# Altium project lightSoakV1-illumination.PrjPcb
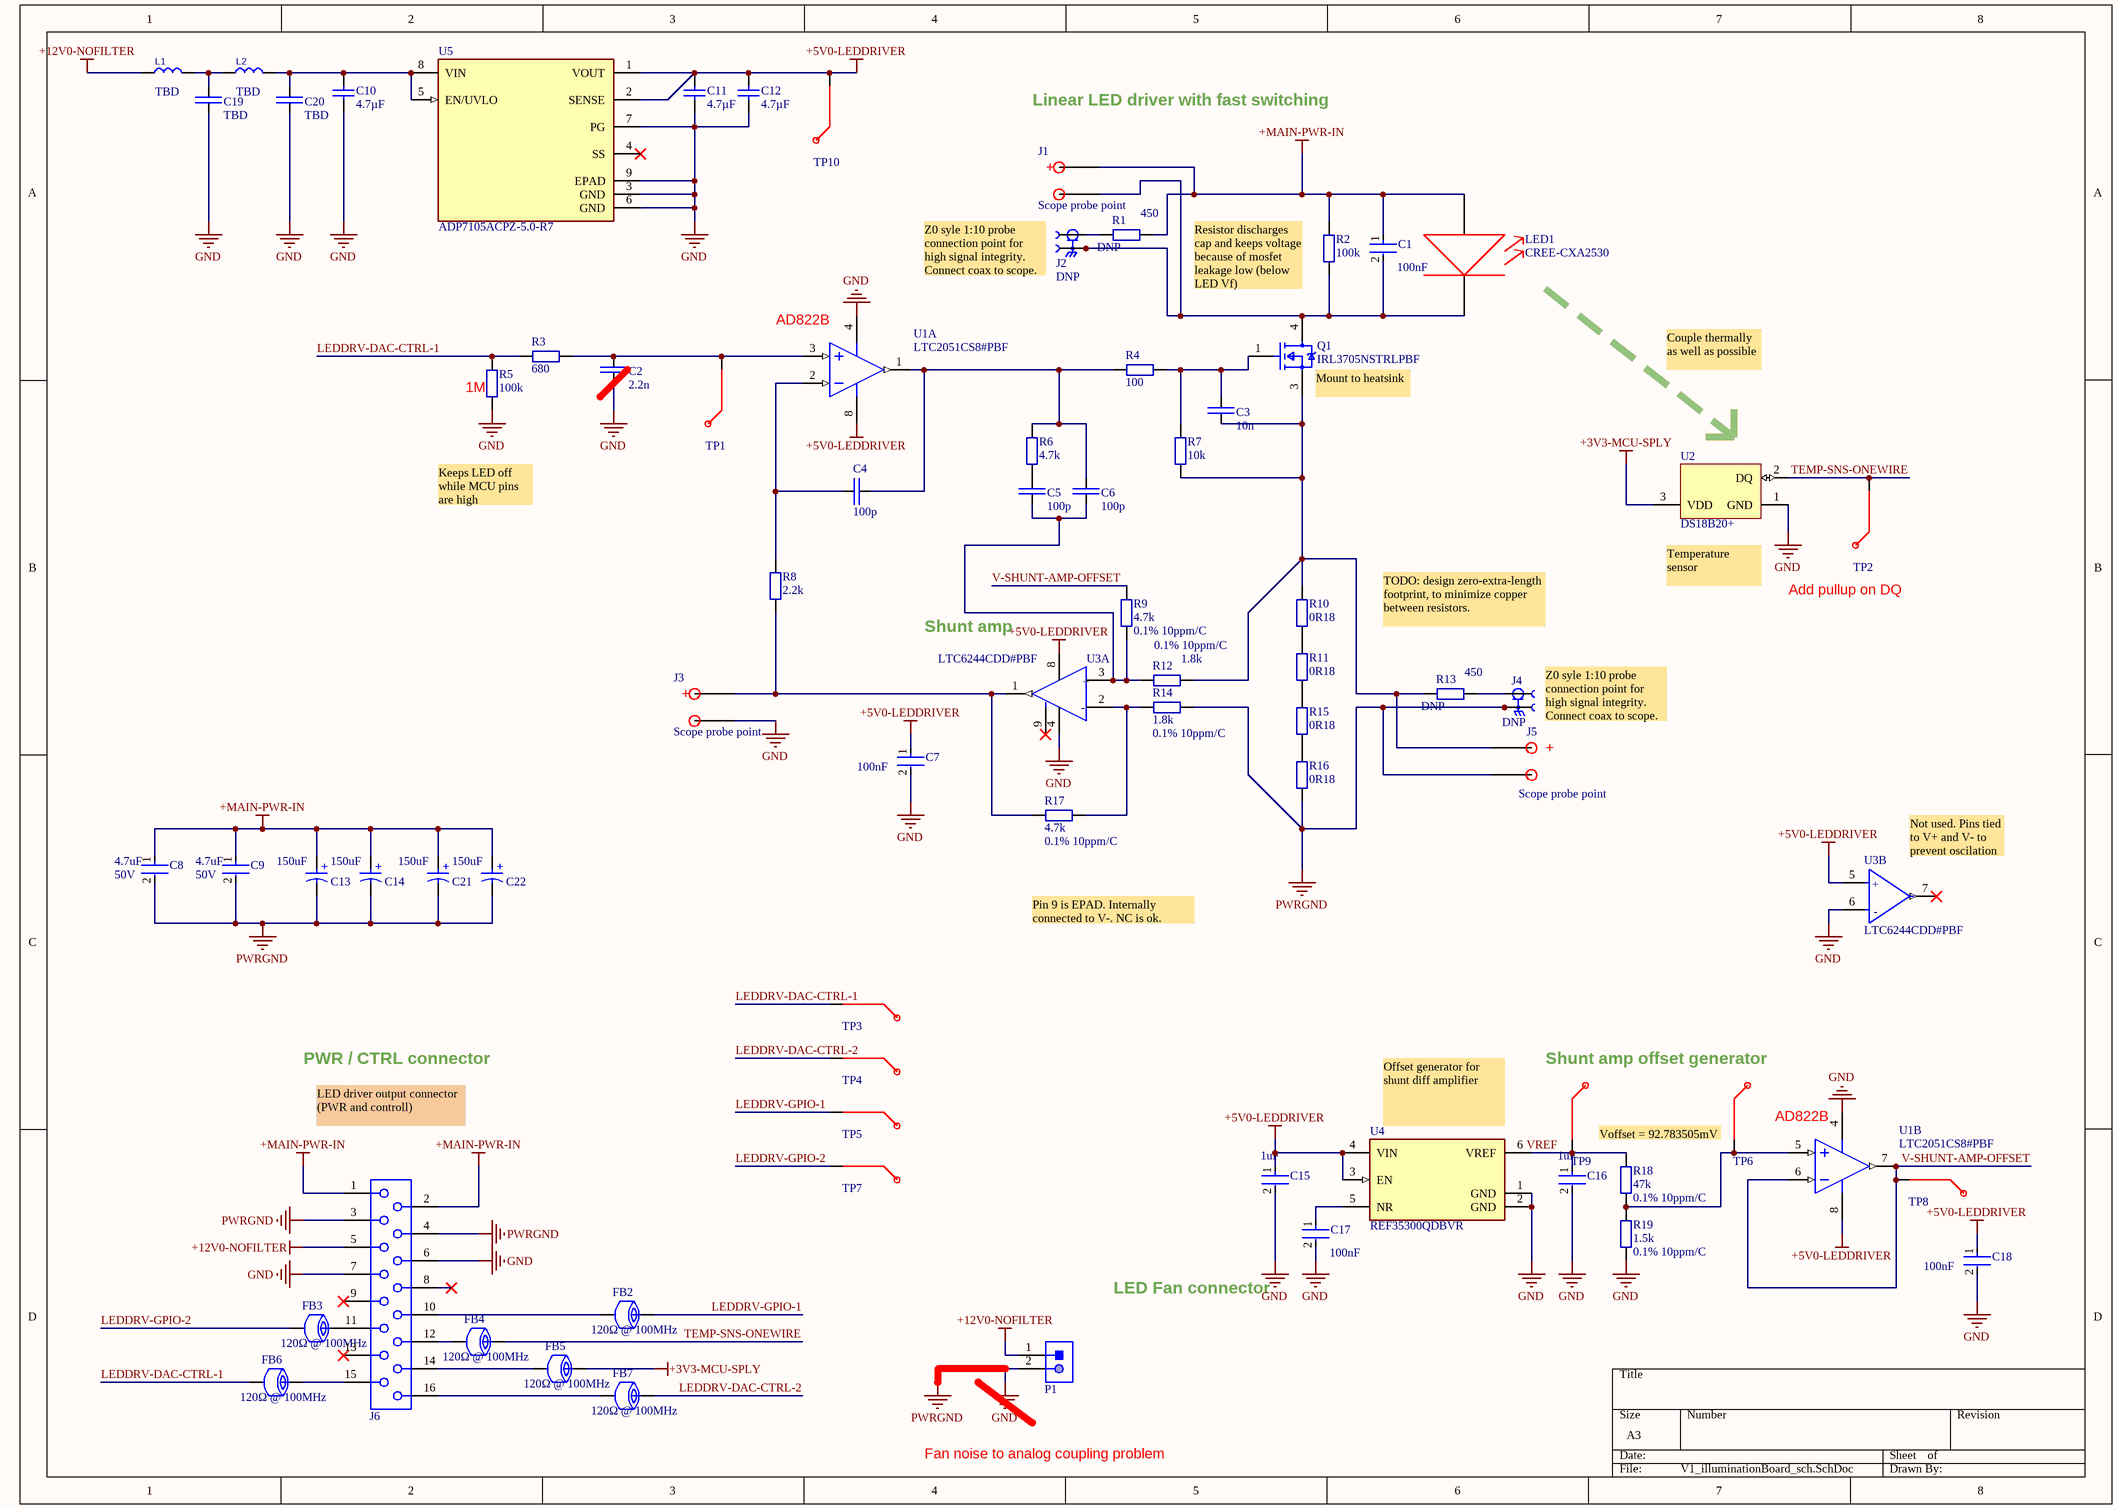
[diagram p0: V1_illuminationBoard_sch.SchDoc]
1 sheet, 73 parts. Net scope: global (net labels, ports and power ports of the same name join across sheets).
Board file: V1-PCB-illumination.PcbDoc

## Sheet V1_illuminationBoard_sch.SchDoc
size A3; SheetNumber: 1; SheetTotal: 1; SPICEModelCacheTWAAQUGS: <root> / <DocumentId>TWAAQUGS</DocumentId> / <CacheFrame Number="0"> / <Model Name="865060657011_150uf" Kind="CKT"> / <Text>******* / .subckt 865060657011_150uF 1 2 / Rser 1 3 0.14 / Lser 2 4 6.4296689103223E-09 / C1 3 4 0.00015 / Rpar 3 4 666666.666666667 / .ends 865060657011_150uF</Text> / </Model> / </CacheFrame> / </root>

### Parts
C1  Capacitance: 100nF  [FP-885012206095-IPC_B]  (hidden comment: 885012206095)
C2  value 2.2n  [FPR_0603_C_R0]  (hidden comment: PN_C0603_2n2)
C3  value 10n  [FPR_0603_C_R0]  (hidden comment: PN_C0603_10n)
C4  value 100p  [FPR_0603_C_R0]  (hidden comment: PN_C0603_100p)
C5  value 100p  [FPR_0603_C_R0]  (hidden comment: PN_C0603_100p)
C6  value 100p  [FPR_0603_C_R0]  (hidden comment: PN_C0603_100p)
C7  Capacitance: 100nF  [FP-885012206095-IPC_B]  (hidden comment: 885012206095)
C8  Voltage Rating (DC): 50V  Capacitance: 4.7uF  [FP-885012208094-IPC_B]  (hidden comment: 885012208094)
C9  Voltage Rating (DC): 50V  Capacitance: 4.7uF  [FP-885012208094-IPC_B]  (hidden comment: 885012208094)
C10  Capacitance: 4.7µF  [WCAP-CSGP_0805_L2W1.25H1.25]  (hidden comment: 885012107018)
C11  Capacitance: 4.7µF  [WCAP-CSGP_0805_L2W1.25H1.25]  (hidden comment: 885012107018)
C12  Capacitance: 4.7µF  [WCAP-CSGP_0805_L2W1.25H1.25]  (hidden comment: 885012107018)
C13  Capacitance: 150uF  [WCAP-ASLL_D10H10.5]  (hidden comment: 865060657011)
C14  Capacitance: 150uF  [WCAP-ASLL_D10H10.5]  (hidden comment: 865060657011)
C15  Capacitance: 1uF  [FP-885012207078-IPC_B]  (hidden comment: 885012207078)
C16  Capacitance: 1uF  [FP-885012207078-IPC_B]  (hidden comment: 885012207078)
C17  Capacitance: 100nF  [FP-885012206095-IPC_B]  (hidden comment: 885012206095)
C18  Capacitance: 100nF  [FP-885012206095-IPC_B]  (hidden comment: 885012206095)
C19  value TBD  [FPR_0603_C_R0]  (hidden comment: PN_C0603_TBD)
C20  value TBD  [FPR_0603_C_R0]  (hidden comment: PN_C0603_TBD)
C21  Capacitance: 150uF  [WCAP-ASLL_D10H10.5]  (hidden comment: 865060657011)
C22  Capacitance: 150uF  [WCAP-ASLL_D10H10.5]  (hidden comment: 865060657011)
FB2  120Ω @ 100MHz  [SMD_0805]
FB3  120Ω @ 100MHz  [SMD_0805]
FB4  120Ω @ 100MHz  [SMD_0805]
FB5  120Ω @ 100MHz  [SMD_0805]
FB6  120Ω @ 100MHz  [SMD_0805]
FB7  120Ω @ 100MHz  [SMD_0805]
J1  Scope probe point  [scope with ground spring probe point]
J2  CONUFL001-SMD-T  [LINX_CONUFL001-SMD-T]  (value not drawn)
J3  Scope probe point  [scope with ground spring probe point]
J4  CONUFL001-SMD-T  [LINX_CONUFL001-SMD-T]  (value not drawn)
J5  Scope probe point  [scope with ground spring probe point]
J6  690368191672  [690368191672]  (value not drawn)
L1  value TBD  [FPR_1216_R_R0]  (hidden comment: L-TBD)
L2  value TBD  [FPR_1216_R_R0]  (hidden comment: L-TBD)
LED1  CREE-CXA2530  [CXA2530-SolderMount]
P1  61300211121  [61300211121]  (value not drawn)
Q1  IRL3705NSTRLPBF  [FP-PG-TO263-3-MFG]
R1  value 450  [FPR_0603_R_R0]  (hidden comment: PN_R0603_450R)
R2  value 100k  [FPR_0603_R_R0]  (hidden comment: PN_R0603_100k)
R3  value 680  [FPR_0603_R_R0]  (hidden comment: PN_R0603_680R)
R4  value 100  [FPR_0603_R_R0]  (hidden comment: PN_R0603_100R)
R5  value 100k  [FPR_0603_R_R0]  (hidden comment: PN_R0603_100k)
R6  value 4.7k  [FPR_0603_R_R0]  (hidden comment: PN_R0603_4k7)
R7  value 10k  [FPR_0603_R_R0]  (hidden comment: PN_R0603_10k)
R8  value 2.2k  [FPR_0603_R_R0]  (hidden comment: PN_R0603_2k2)
R9  value 4.7k  Tolerance: 0.1% 10ppm/C  [FPR_0603_R_R0]  (hidden comment: PN_R0603_4k7_0%1_10ppm)
R10  value 0R18  [FPR_CRF2512_R0-endToEnd]  (hidden comment: TLRP3A30CR180FTE)
R11  value 0R18  [FPR_CRF2512_R0-endToEnd]  (hidden comment: TLRP3A30CR180FTE)
R12  value 1.8k  Tolerance: 0.1% 10ppm/C  [FPR_0603_R_R0]  (hidden comment: PN_R0603_1k8_0%1_10ppm)
R13  value 450  [FPR_0603_R_R0]  (hidden comment: PN_R0603_450R)
R14  value 1.8k  Tolerance: 0.1% 10ppm/C  [FPR_0603_R_R0]  (hidden comment: PN_R0603_1k8_0%1_10ppm)
R15  value 0R18  [FPR_CRF2512_R0-endToEnd]  (hidden comment: TLRP3A30CR180FTE)
R16  value 0R18  [FPR_CRF2512_R0-endToEnd]  (hidden comment: TLRP3A30CR180FTE)
R17  value 4.7k  Tolerance: 0.1% 10ppm/C  [FPR_0603_R_R0]  (hidden comment: PN_R0603_4k7_0%1_10ppm)
R18  value 47k  Tolerance: 0.1% 10ppm/C  [FPR_0603_R_R0]  (hidden comment: PN_R0603_47k_0%1_10ppm)
R19  value 1.5k  Tolerance: 0.1% 10ppm/C  [FPR_0603_R_R0]  (hidden comment: PN_R0603_1k5_0%1_10ppm)
TP1  Test Point  [Test Point 1.5mm SMD]  (value not drawn)
TP2  Test Point  [Test Point 1.5mm SMD]  (value not drawn)
TP3  Test Point  [Test Point 1.5mm SMD]  (value not drawn)
TP4  Test Point  [Test Point 1.5mm SMD]  (value not drawn)
TP5  Test Point  [Test Point 1.5mm SMD]  (value not drawn)
TP6  Test Point  [Test Point 1.5mm SMD]  (value not drawn)
TP7  Test Point  [Test Point 1.5mm SMD]  (value not drawn)
TP8  Test Point  [Test Point 1.5mm SMD]  (value not drawn)
TP9  Test Point  [Test Point 1.5mm SMD]  (value not drawn)
TP10  Test Point  [Test Point 1.5mm SMD]  (value not drawn)
U1  LTC2051CS8#PBF  [LT-S8-8_N]  (parts A,B of 2)
U2  DS18B20+  [to-92 horiyontal boardhole]
U3  LTC6244CDD#PBF  [FP-DD-8-05-08-1698-IPC_A]  (parts A,B of 2)
U4  REF35300QDBVR  [FP-DBV0006A-MFG]
U5  ADP7105ACPZ-5.0-R7  [FP-CP-8-5-IPC_C]

### Nets
+3V3-MCU-SPLY: FB5.1 U2.3(VDD)
+5V0-LEDDRIVER: C7.1 C11.2 C12.2 C15.1 C18.1 TP10.1 U1.8(V+) U3.5(+IN_B) U3.8(V+) U4.3(EN) U4.4(VIN) U5.1(VOUT) U5.2(SENSE)
+12V0-NOFILTER: J6.5 L1.1 P1.1
+MAIN-PWR-IN: C1.1 C8.1 C9.1 C13.1(P) C14.1(P) C21.1(P) C22.1(P) J1.POS J6.1 J6.2 LED1.POS R1.2 R2.2
GND: C2.2 C7.2 C10.1 C11.1 C12.1 C15.2 C16.2 C17.2 C18.2 C19.1 C20.1 J3.NEG J6.6 J6.7 P1.2 R5.1 R19.2 U1.4(V-) U2.1(GND) U3.4(V-) U3.6(-IN_B) U4.1(GND) U4.2(GND) U5.3(GND) U5.6(GND) U5.7(PG) U5.9(EPAD)
PWRGND: C8.2 C9.2 C13.2(N) C14.2(N) C21.2(N) C22.2(N) J4.2 J4.3 J5.NEG J6.3 J6.4 R14.2 R16.1
LEDDRV-DAC-CTRL-1: FB6.2 R3.2 R5.2 TP3.1
LEDDRV-DAC-CTRL-2: FB7.1 TP4.1
LEDDRV-GPIO-1: FB2.1 TP5.1
LEDDRV-GPIO-2: FB3.2 TP7.1
TEMP-SNS-ONEWIRE: FB4.1 TP2.1 U2.2(DQ)
V-SHUNT-AMP-OFFSET: R9.2 TP8.1 U1.6(-IN_B) U1.7(OUT_B)
VREF: C16.1 R18.1 TP9.1 U4.6(VREF)
NetC1_2: C1.2 J1.NEG J2.2 J2.3 LED1.NEG Q1.4(DRAIN) R2.1
NetC2_1: C2.1 R3.1 TP1.1 U1.3(+IN_A)
NetC3_1: C3.1 J5.POS Q1.3(SOURCE) R7.1 R10.2 R12.1 R13.2
NetC3_2: C3.2 Q1.1(GATE) R4.2 R7.2
NetC4_1: C4.1 C6.1 R4.1 R6.2 U1.1(OUT_A)
NetC4_2: C4.2 R8.2 U1.2(-IN_A)
NetC5_1: C5.1 R6.1
NetC5_2: C5.2 C6.2 R9.1 R12.2 U3.3(+IN_A)
NetC10_2: C10.2 C20.2 L2.2 U5.5(EN/UVLO) U5.8(VIN)
NetC17_1: C17.1 U4.5(NR)
NetC19_2: C19.2 L1.2 L2.1
NetFB2_2: FB2.2 J6.10
NetFB3_1: FB3.1 J6.11
NetFB4_2: FB4.2 J6.12
NetFB5_2: FB5.2 J6.14
NetFB6_1: FB6.1 J6.15
NetFB7_2: FB7.2 J6.16
NetJ2_1: J2.1 R1.1
NetJ3_POS: J3.POS R8.1 R17.1 U3.1(OUT_A)
NetJ4_1: J4.1 R13.1
NetR10_1: R10.1 R11.2
NetR11_1: R11.1 R15.2
NetR14_1: R14.1 R17.2 U3.2(-IN_A)
NetR15_1: R15.1 R16.2
NetR18_2: R18.2 R19.1 TP6.1 U1.5(+IN_B)

Not connected (* = marked no-connect by the designer): J6 8* 9* 13*; U3 7(OUT_B)* 9(V-)*; U5 4(SS)*

### Notes on the sheet
- Linear LED driver with fast switching
- (near J2) Z0 syle 1:10 probe connection point for high signal integrity. Connect coax to scope.
- (near R2) Resistor discharges cap and keeps voltage because of mosfet leakage low (below LED Vf)
- (near U1) AD822B
- Couple thermally as well as possible
- (near R5) 1M
- (near Q1) Mount to heatsink
- Keeps LED off while MCU pins are high impedance
- (near U2) Temperature sensor
- Shunt amp
- TODO: design zero-extra-length footprint, to minimize copper between resistors.
- Add pullup on DQ
- (near J4) Z0 syle 1:10 probe connection point for high signal integrity. Connect coax to scope.
- (near U3) Not used. Pins tied to V+ and V- to prevent oscilation
- Pin 9 is EPAD. Internally connected to V-. NC is ok.
- PWR / CTRL connector
- Shunt amp offset generator
- LED driver output connector (PWR and controll)
- (near U4) Offset generator for shunt diff amplifier
- Voffset = 92.783505mV
- LED Fan connector
- Fan noise to analog coupling problem
- Labels drawn without touching a wire or pin: PWRGND
- (in symbol 865060657011) +
- (in symbol CMP-09116-000458-1, part A) +
- (in symbol CMP-09116-000458-1, part B) +
- (in symbol Scope probe point) +

### Library data of the parts
C1 C7 C17 C18 = CMP-207839-000004-1: CAP CER 0.1UF 50V X7R 0603; Tolerance: 10%; RoHS Compliant: Yes; Thickness: 0.037inch; Voltage Rating: 50V; Packaging: Cut Tape; Dielectric: X7R; Series: WCAP-CSGP; Width: 0.031inch; Max Operating Temperature: 125°C; Min Operating Temperature: -55°C; Case/Package: 0603; Case Code (Metric): 1608; Case Code (Imperial): 0603; Length: 0.063inch; Mount: Surface Mount; Voltage Rating (DC): 50V
C2-C6 C19 C20 = C: Capacitor - generic SMD
C8 C9 = CMP-207839-000019-1: CAP CER 4.7UF 50V X7R 1206; Tolerance: 10%; Mount: Surface Mount; Width: 0.063inch; Min Operating Temperature: -55°C; RoHS Compliant: Yes; Dielectric: X7R; Series: WCAP-CSGP; Case Code (Metric): 3216; Case/Package: 1206; Max Operating Temperature: 125°C; Thickness: 0.075inch; Packaging: Cut Tape; Length: 0.126inch; Voltage Rating: 50V; Case Code (Imperial): 1206
C10-C12 = 885012107018: WCAP-CSGP Multilayer Ceramic Chip Capacitor, General Purpose, size 0805, X5R, 4.7µF, 25VDC; Manufacturer: Wurth Elektronik; Case/Size Code: 0805; Capacitance Tolerance: +/-20%; Dissipation Factor: 10%; Insulation Resistance: 0.02GΩ; Rated Voltage (DC): 25V; Technical Reference: X5R0805475M025DFCT10000; Manufacturer Part Number: 885012107018; Category: Multilayer Ceramic Chip Capacitors; Match Code: WCAP-CSGP; ComponentLink1Description: Website Link; ComponentLink1URL: https://www.we-online.com/redexpert/article/885012107018?ad; ComponentLink2Description: Datasheet Link; ComponentLink2URL: https://www.we-online.com/redexpert/spec/885012107018?ad; Mount: Surface Mount; Operating Temperature Max: 85°C; Operating Temperature Min: -55°C; Packaging: Tape and Reel; Length: 2mm; Width: 1.25mm; Height: 1.25mm; Ceramic Type: X5R
C13 C14 C21 C22 = 865060657011: WCAP-ASLL Aluminum Electrolytic Capacitor, V-Chip, D10 x H10.5mm, 150µF, 50V; Manufacturer: Wurth Elektronik; Capacitance Tolerance: +/-20%; Dissipation Factor: 12%; Endurance: 5000h; Leakage Current: 75uA; Ripple Current: 555mA; Technical Reference: ASEF105151M050DVCTEE000; Manufacturer Part Number: 865060657011; Category: Aluminum Electrolytic Capacitors; Match Code: WCAP-ASLL; ComponentLink1Description: Website Link; ComponentLink1URL: https://www.we-online.com/redexpert/article/865060657011?ad; ComponentLink2Description: Datasheet Link; ComponentLink2URL: https://www.we-online.com/redexpert/spec/865060657011?ad; Mount: Surface Mount; Operating Temperature Max: 105°C; Operating Temperature Min: -55°C; Packaging: Tape and Reel; Height: 10.5mm; Diameter: 10mm; Rated Voltage (DC): 50V
C15 C16 = CMP-207839-000010-1: CAP CER 1UF 25V X7R 0805; Tolerance: 10%; Series: WCAP-CSGP; Mount: Surface Mount; RoHS Compliant: Yes; Case Code (Metric): 2012; Width: 0.049inch; Thickness: 0.053inch; Dielectric: X7R; Max Operating Temperature: 125°C; Case Code (Imperial): 0805; Case/Package: 0805; Length: 0.079inch; Voltage Rating: 25V; Packaging: Cut Tape; Min Operating Temperature: -55°C; Voltage Rating (DC): 25V
FB2-FB7 = BLM21AG121SN1D: Ferrite Bead, 0805 [2012 Metric], 120 ohm, 800 mA, BLM21A Series, 0.15 ohm, ± 25%; Manufacturer: Murata; Dealer number: 1515617; Dealer: Farnell; DC resistance: 0.15Ω; Max current: 0.2A; Category: ferite beads; Price: 0.082; Manufacturer Number: BLM21AG121SN1D; AC resistance: 120Ω; Frequency: 100MHz; Case: 0805; Technology: SMT; HelpURL: https://www.farnell.com/datasheets/1914683.pdf
J2 J4 = CONUFL001-SMD-T: U.FL (UMCC) Connector Jack, Male Pin 50Ohm Surface Mount Solder; MF: Linx; Price: None; MP: CONUFL001-SMD-T; Package: None; Value: *; Check_prices: https://www.snapeda.com/parts/CONUFL001-SMD-T/Linx/view-part/?ref=eda; Availability: Unavailable; SnapEDA_Link: https://www.snapeda.com/parts/CONUFL001-SMD-T/Linx/view-part/?ref=snap; DNP: DNP
J6 = 690368191672: WR-MM Mini Module Connector, Female, THT, with Latch & Polarization, Angled, pitch 2.54mm, 16p; Manufacturer: Wurth Elektronik; Contact Resistance: 10mΩ; Insulation Resistance: 1000MΩ; Rated Current: 1.5A; Working Voltage: 250VAC; Withstanding Voltage: 500VAC; ComponentLink1Description: Website Link; ComponentLink1URL: https://www.we-online.com/redexpert/article/690368191672?ad; ComponentLink2Description: Datasheet Link; ComponentLink2URL: https://www.we-online.com/redexpert/spec/690368191672?ad; Manufacturer Part Number: 690368191672; Category: Board-to-Board Connectors; Match Code: WR-MM; Mount: Through Hole; Operating Temperature Max: 105°C; Operating Temperature Min: -40°C; Packaging: Tube; Length: 24.92mm; Gender: Female; Number of Pins: 16; Orientation: Angled; Pitch: 2.54mm
L1 L2 = L: Inductor - generic SMD
LED1 = CREE CXA2530: High power LED
P1 = CMP-1712-00002-4: THT Vertical Pin Header WR-PHD, Pitch 2.54 mm, Single Row, 2 pins; Manufacturer: Wurth Elektronik; Rated Current: 3A; Gender: Male; Withstanding Voltage: 500VAC; Working Voltage: 250VAC; Pitch: 2.54mm; Contact Resistance: 20mOhm; Pin Number: 2; Mounting Technology: THT; Orientation: Vertical; Operating Temperature: -40to105degC; Packaging: Bag; Publisher: WurthElektronik; Datasheet URL: https://katalog.we-online.de/em/datasheet/6130xx11121.pdf; Manufacturer URL: http://www.we-online.de; Row Number: Single; Package Reference: 61300211121; Part Number: 61300211121
Q1 = CMP-32901-000287-1: MOSFET N-CH 55V 89A D2PAK; Rds On Max: 10mR; Turn-On Delay Time: 12ns; Turn-Off Delay Time: 37ns; Max Power Dissipation: 3.8W; Rise Time: 140ns; Gate to Source Voltage (Vgs): 16V; Drain to Source Resistance: 18mR; Element Configuration: Single; Power Dissipation: 170W; Input Capacitance: 3.6nF; Max Operating Temperature: 175°C; Min Operating Temperature: -55°C; Halogen Free: Halogen Free; Length: 0.42inch; RoHS Compliant: Yes; Drain to Source Voltage (Vdss): 55V; Height: 0.185inch; REACH SVHC: No SVHC; Number of Pins: 3; Packaging: Tape and Reel; Drain to Source Breakdown Voltage: 55V; Case/Package: D2PAK; Threshold Voltage: 16V; Lead Free: Contains Lead; Continuous Drain Current (ID): 89A; Mount: Surface Mount; Width: 0.38inch; Contact Plating: Tin; Max Dual Supply Voltage: 55V
R1-R19 = R: Resistor - generic SMD
  R1 R13: DNP: DNP
U1 = CMP-0359-03435-2: Dual Channel, Zero-Drift Operational Amplifier, 3 MHz Typical GBW, 2 V/us Typical SR, 2.7 to 6 V, 8-Pin SOIC (S8-8), Commercial, Pb-Free; Manufacturer: Linear Technology; Vos (mV) Typical: 0.0005; Vs Min (V): 2.7; Is (mA) Typical: 0.85; Channels (#): 2; GBW (MHz) Typical: 3; Vs Max (V): 6; ComponentLink3Description: Package Specification; PackageReference: LT-S8-8; ComponentLink1URL: http://www.linear.com/; PartNumber: LTC2051CS8#PBF; ComponentLink3URL: http://cds.linear.com/docs/en/packaging/05081610_G_SO8.pdf; Linear Technology Part Number: LTC2051; ComponentLink2URL: http://cds.linear.com/docs/en/datasheet/20512fd.pdf; ComponentLink1Description: Manufacturer URL; ComponentLink2Description: Datasheet; SR (V/us) Typical: 2; Type: ZD; PackageDescription: 8-Pin Plastic Small Outline, Body 4.9 x 3.9 mm, Pitch 1.27 mm; RevisionNote: URLs updated; PackageVersion: Rev G; RoHS: Pb-Free; Mounting Technology: Surface Mount; DatasheetVersion: Rev. D
U2 = CMP-0253-00003-1: Programmable Resolution Digital Thermometer, 1-Wire Interface, ±0.5°C Accuracy, 3-Pin TO92, -55°C to +125°C, Pb-Free; ComponentLink2URL: http://datasheets.maxim-ic.com/en/ds/DS18B20.pdf; PackageReference: Q3+1; ComponentLink1Description: Manufacturer URL; PackageDescription: TO-92 Package, Body Dia. 4.7mm; Leads 0.51 x 0.51 mm (max), Pb-Free; DatasheetVersion: 2007; Code_JEDEC: TO-226-AA; ComponentLink1URL: http://www.maxim-ic.com; PackageVersion: revB, 2009; ComponentLink2Description: Datasheet
U3 = CMP-09116-000458-1: IC CMOS 2 CIRCUIT 8DFN; Amplifier Type: GENERAL PURPOSE; Output Current per Channel: 55mA; Gain Bandwidth Product: 50MHz; Min Dual Supply Voltage: 1.4V; Number of Elements: 2; Max Supply Voltage: 10.5V; Slew Rate: 40V/µs; Min Supply Voltage: 2.8V; Operating Supply Current: 7mA; Voltage Gain: 127.96dB; Common Mode Rejection Ratio: 74dB; Input Offset Voltage (Vos): 100uV; Dual Supply Voltage: 5V; Power Supply Rejection Ratio (PSRR): 75dB; Max Dual Supply Voltage: 5.25V; Input Bias Current: 1pA; Mount: Surface Mount; Max Operating Temperature: 70°C; Number of Pins: 8; Technology: CMOS; Case/Package: DFN; Packaging: Rail/Tube; RoHS Compliant: Yes; Lead Free: Lead Free; Number of Circuits: 2; Package Quantity: 121; Unity Gain Bandwidth Product: 50MHz; Series: -; Min Operating Temperature: 0°C
U4 = CMP-04916-000061-1: 650-NA QUIESCENT CURRENT, 12-PPM, 3V out
U5 = CMP-09138-000117-1: IC REG LINEAR 5V 500MA 8LFCSP; Polarity: Positive; Power Supply Rejection Ratio (PSRR): 50dB; Min Output Voltage: 1.22V; Quiescent Current: 900uA; Number of Regulators: 1; Min Input Voltage: 3.3V; Dropout Voltage: 350mV; Min Current Limit: 625mA; Max Input Voltage: 20V; Reference Voltage: 1.23V; Operating Supply Current: 900mA; Max Output Voltage: 19V; Output Type: Fixed; Accuracy: 0.8%; Output Current: 500mA; Max Output Current: 500mA; Number of Outputs: 1; Max Supply Current: 900uA; Number of Pins: 8; Output Voltage: 5V; Package Quantity: 1500; RoHS Compliant: Yes; Lead Free: Contains Lead; Packaging: Tape and Reel; Max Operating Temperature: 125°C; Mount: Surface Mount; Min Operating Temperature: -40°C; Contact Plating: Tin